# Altium schematic sheet GOST.SchDoc
size 594 x 420 mm
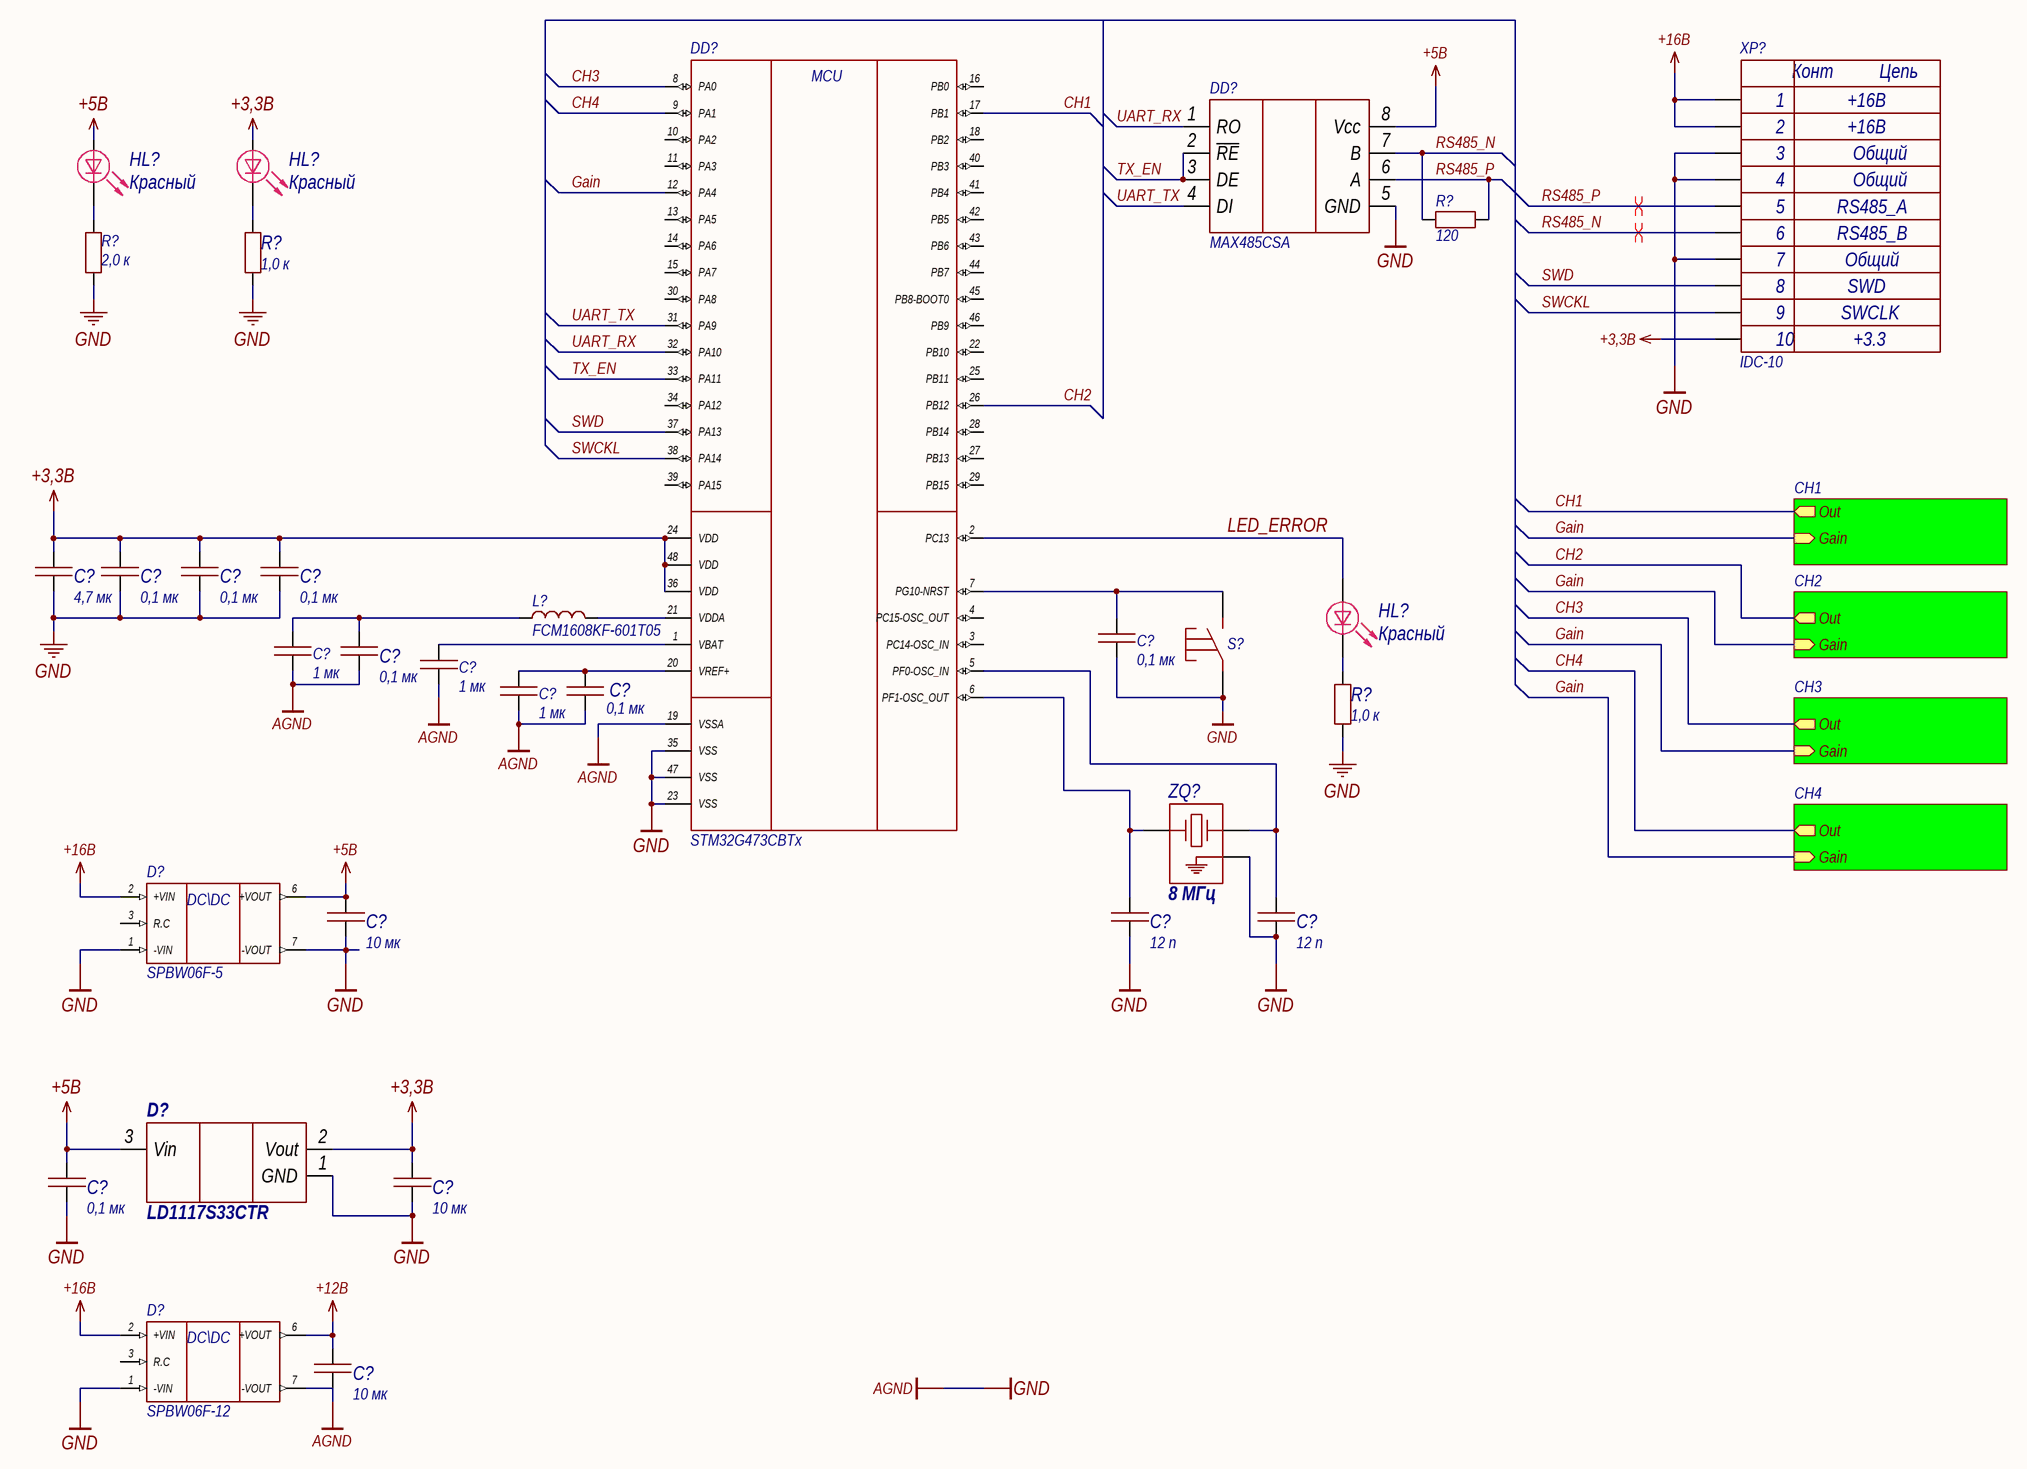
[diagram p0: GOST.SchDoc]

## Parts
(Parts that share a designator on the sheet are numbered #1, #2 ... from top to bottom, then left to right.)
C?#1  value 4,7 мк  [1206C]  (hidden comment: Capacitor)
C?#2  value 0,1 мк  [0603C]  (hidden comment: Capacitor)
C?#3  value 0,1 мк  [0603C]  (hidden comment: Capacitor)
C?#4  value 0,1 мк  [0603C]  (hidden comment: Capacitor)
C?#5  value 0,1 мк  [0603C]  (hidden comment: Capacitor)
C?#6  value 1 мк  [0603C]  (hidden comment: Capacitor)
C?#7  value 0,1 мк  [0603C]  (hidden comment: Capacitor)
C?#8  value 1 мк  [0603C]  (hidden comment: Capacitor)
C?#9  value 1 мк  [0603C]  (hidden comment: Capacitor)
C?#10  value 0,1 мк  [0603C]  (hidden comment: Capacitor)
C?#11  value 10 мк  [1210C]  (hidden comment: Capacitor)
C?#12  value 12 п  [0603C]  (hidden comment: Capacitor)
C?#13  value 12 п  [0603C]  (hidden comment: Capacitor)
C?#14  value 0,1 мк  [0603C]  (hidden comment: Capacitor)
C?#15  value 10 мк  [1210C]  (hidden comment: Capacitor)
C?#16  value 10 мк  [1210C]  (hidden comment: Capacitor)
D?#1  SPBW06F-5  [CONV_SPBW06F-12]
D?#2  LD1117S33CTR  [SOT223]
D?#3  SPBW06F-12  [CONV_SPBW06F-12]
DD?#1  STM32G473CBTx  [LQFP48-7x7mm]
DD?#2  MAX485CSA  [SOIC-8]
HL?#1  Color: Красный  [0805D]  (hidden comment: LED)
HL?#2  Color: Красный  [0805D]  (hidden comment: LED)
HL?#3  Color: Красный  [0805D]  (hidden comment: LED)
L?  FCM1608KF-601T05  [0603L]
R?#1  value 120  [0603R]  (hidden comment: Resistor)
R?#2  value 2,0 к  [0603R]  (hidden comment: Resistor)
R?#3  value 1,0 к  [0603R]  (hidden comment: Resistor)
R?#4  value 1,0 к  [0603R]  (hidden comment: Resistor)
S?  TSS-TD-19XA-XTR  [TSS-TD-19XA-XTR]  (value not drawn)
XP?  IDC-10  Value1: +16В  Value3: Общий  Value5: RS485_A  Value6: RS485_B  Value8: SWD  Value9: SWCLK  Value10: +3.3  [IDC-10]
ZQ?  value 8 МГц  [QSMD3.2x2.5]  (hidden comment: XTAL_GND)

## Sub-sheets
CH1 = Chanel.SchDoc: Out (out), Gain (in)
CH2 = Chanel.SchDoc: Out (out), Gain (in)
CH3 = Chanel.SchDoc: Out (out), Gain (in)
CH4 = Chanel.SchDoc: Out (out), Gain (in)

## Nets
+3,3В: C?#1.2 C?#2.2 C?#3.2 C?#4.2 C?#15.2 D?#2.2(Vout) DD?#1.24(VDD) DD?#1.36(VDD) DD?#1.48(VDD) HL?#2.1 XP?.10
+5В: C?#11.2 C?#14.2 D?#1.6(+VOUT) D?#2.3(Vin) DD?#2.8(Vcc) HL?#1.1
+12В: C?#16.2 D?#3.6(+VOUT)
+16В: D?#1.2(+VIN) D?#3.2(+VIN) XP?.1 XP?.2
AGND: C?#1.1 C?#2.1 C?#3.1 C?#4.1 C?#5.1 C?#6.1 C?#7.1 C?#8.1 C?#9.1 C?#10.1 C?#11.1 C?#12.1 C?#13.1 C?#14.1 C?#15.1 C?#16.1 D?#1.1(-VIN) D?#1.7(-VOUT) D?#2.1(GND) D?#3.1(-VIN) D?#3.7(-VOUT) DD?#1.19(VSSA) DD?#1.23(VSS) DD?#1.35(VSS) DD?#1.47(VSS) DD?#2.5(GND) R?#2.1 R?#3.1 R?#4.1 S?.1 XP?.3 XP?.4 XP?.7 ZQ?.3  [also labelled GND]
CH1: DD?#1.17(PB1) ; sheet CH1/Out
CH2: DD?#1.26(PB12) ; sheet CH2/Out
CH3: DD?#1.8(PA0) ; sheet CH3/Out
CH4: DD?#1.9(PA1) ; sheet CH4/Out
Gain: DD?#1.12(PA4) ; sheet CH1/Gain, sheet CH2/Gain, sheet CH3/Gain, sheet CH4/Gain
LED_ERROR: DD?#1.2(PC13) HL?#3.1
RS485_N: DD?#2.7(B) R?#1.2 XP?.6
RS485_P: DD?#2.6(A) R?#1.1 XP?.5
SWCKL: DD?#1.38(PA14) XP?.9
SWD: DD?#1.37(PA13) XP?.8
TX_EN: DD?#1.33(PA11) DD?#2.2(~{RE}) DD?#2.3(DE)
UART_RX: DD?#1.32(PA10) DD?#2.1(RO)
UART_TX: DD?#1.31(PA9) DD?#2.4(DI)
NetC?#5_2: C?#5.2 DD?#1.7(PG10-NRST) S?.2
NetC?#6_2: C?#6.2 C?#7.2 L?.1
NetC?#8_2: C?#8.2 DD?#1.1(VBAT)
NetC?#9_2: C?#9.2 C?#10.2 DD?#1.20(VREF+)
NetC?#12_2: C?#12.2 DD?#1.6(PF1-OSC_OUT) ZQ?.1
NetC?#13_2: C?#13.2 DD?#1.5(PF0-OSC_IN) ZQ?.2
NetDD?#1_21: DD?#1.21(VDDA) L?.2
NetHL?#1_2: HL?#1.2 R?#2.2
NetHL?#2_2: HL?#2.2 R?#3.2
NetHL?#3_2: HL?#3.2 R?#4.2

Not connected (* = marked no-connect by the designer): D?#1 3(R.C); D?#3 3(R.C); DD?#1 3(PC14-OSC_IN) 4(PC15-OSC_OUT) 10(PA2) 11(PA3) 13(PA5) 14(PA6) 15(PA7) 16(PB0) 18(PB2) 22(PB10) 25(PB11) 27(PB13) 28(PB14) 29(PB15) 30(PA8) 34(PA12) 39(PA15) 40(PB3) 41(PB4) 42(PB5) 43(PB6) 44(PB7) 45(PB8-BOOT0) 46(PB9)

## Layout directives
differential pair: RS485_N, RS485_P

## Notes on the sheet
- Перв. примен.
- Справ. №
- Подп. и дата
- Инв. № дубл.
- Взам. инв. №
- Разраб.
- Изм.
- Лист
- № докум.
- Подп.
- Дата
- Лит.
- Масса
- Масштаб
- Пров.
- Т.контр.
- Схема электрическая принципиальная
- Листов
- Инв. № подл.
- Утв.
- Н.контр.
- Копировал
- Формат А2
- (in symbol IDC-10) Конт; Цепь
- (in symbol SPBW06F-12) DC\DC
- (in symbol STM32G473CBTx) MCU

## Library data of the parts
C?#1 = Capacitor_4,7u_10_50V_X7R_1206C: Конденсатор; Library Path2: Schematic\Capacitor.SchLib; Tolerance: 0,1; Voltage (V): 50; Dielectric: X7R; Capacity (nF): 4700; Part Number: Capacitor_4,7u_10_50V_X7R_1206C
C?#2-C?#4 C?#7 C?#10 C?#14 = Capacitor_0,1u_10_50V_X7R_0603C: Конденсатор; Library Path2: Schematic\Capacitor.SchLib; Tolerance: 0,1; Voltage (V): 50; Dielectric: X7R; Capacity (nF): 100; Part Number: Capacitor_0,1u_10_50V_X7R_0603C
C?#5 = Capacitor_0,1u_10_50V_X7R_0603C: Конденсатор 0603C ёмкостью 0,1 мк 10%, 50 В, X7R; Voltage (V): 50; Capacity (nF): 100; Part Number: Capacitor_0,1u_10_50V_X7R_0603C; Tolerance: 10%; Dielectric: X7R
C?#6 C?#8 C?#9 = Capacitor_1u_10_50V_X7R_0603C: Конденсатор 0603C ёмкостью 1 мк 10%, 50 В, X7R; Voltage (V): 50; Capacity (nF): 1000; Part Number: Capacitor_1u_10_50V_X7R_0603C; Tolerance: 10%; Dielectric: X7R
C?#11 C?#15 C?#16 = Capacitor_10u_10_35V_X7R_1210C: Конденсатор; Library Path2: Schematic\Capacitor.SchLib; Tolerance: 0,1; Voltage (V): 35; Dielectric: X7R; Capacity (nF): 10000; Part Number: Capacitor_10u_10_35V_X7R_1210C
C?#12 C?#13 = 0,1 мк: Конденсатор 12п; Part Number: Capacitor
D?#1 D?#3 = SPBW06F-12: Isolated Module DC DC Converter 1 Output 12V - - - 500mA 9V - 36V Input; MF: MEAN WELL; SnapEDA_Link: https://www.snapeda.com/parts/SPBW06F-12/Mean+Well/view-part/?ref=snap; Package: SIP-8 Mean Well; Value: *; MP: SPBW06F-12; Check_prices: https://www.snapeda.com/parts/SPBW06F-12/Mean+Well/view-part/?ref=eda
D?#2 = LD1117S33CTR: Линейный стабилизатор напряжения; Part Number: LD1117S33CTR
DD?#1 = STM32G473CBTx: Mainstream Arm Cortex-M4 core with DSP and FPU, 170MHz with 128Kbytes of Flash memory, Math Accelerator, High Analog level integration; Manufacturer_Part_Number: stm32g4_lqfp48_t1; Built_By: EMA_Jessica; Vendor: STMicroelectronics; Copyright: Copyright (C) 2016 Accelerated Designs. All rights reserved; RefDes: RefDes; Type: DEV; Value: Value
DD?#2 = MAX485CSA: RS-485 приёмопередатчик; Part Number: MAX485CSA
HL?#1-HL?#3 = LED: Светодиод; Part Number: LED
L? = Inductance: Катушка индуктивности; Part Number: Inductance
R?#1 = Resistor_120_1_0603: Резистор номиналом 120 Ом 1%; Power: *; Part Number: Resistor_120_1_0603; Tolerance: 1%
R?#2 = Resistor_2.0k_1_0603: Резистор номиналом 2,0 кОм 1%; Power: *; Part Number: Resistor_2.0k_1_0603; Tolerance: 1%
R?#3 R?#4 = Resistor_1.0k_1_0603: Резистор номиналом 1,0 кОм и точностью 1%; Power: *; Part Number: Resistor_1.0k_1_0603; Tolerance: 1%
S? = TSS-TD-19XA-XTR: Тактовая кнопка; Автор: glebmih; Part Number: TSS-TD-19XA-XTR; Datasheet: https://cdn.promelec.ru/upload/items/2023/04/17/TSS-TD-19XA.pdf
XP? = IDC-10: 10-пиновый разъём с ключём; System: Connector; Value2: +16В; Value4: Общий; Value7: Общий; Part Number: IDC-10
ZQ? = XTAL_GND: Кварцевый резонатор с входом земли; Part Number: XTAL_GND